# EAGLE schematic Week2ATTINY4-5-9-10 (EAGLE 8.4.3)
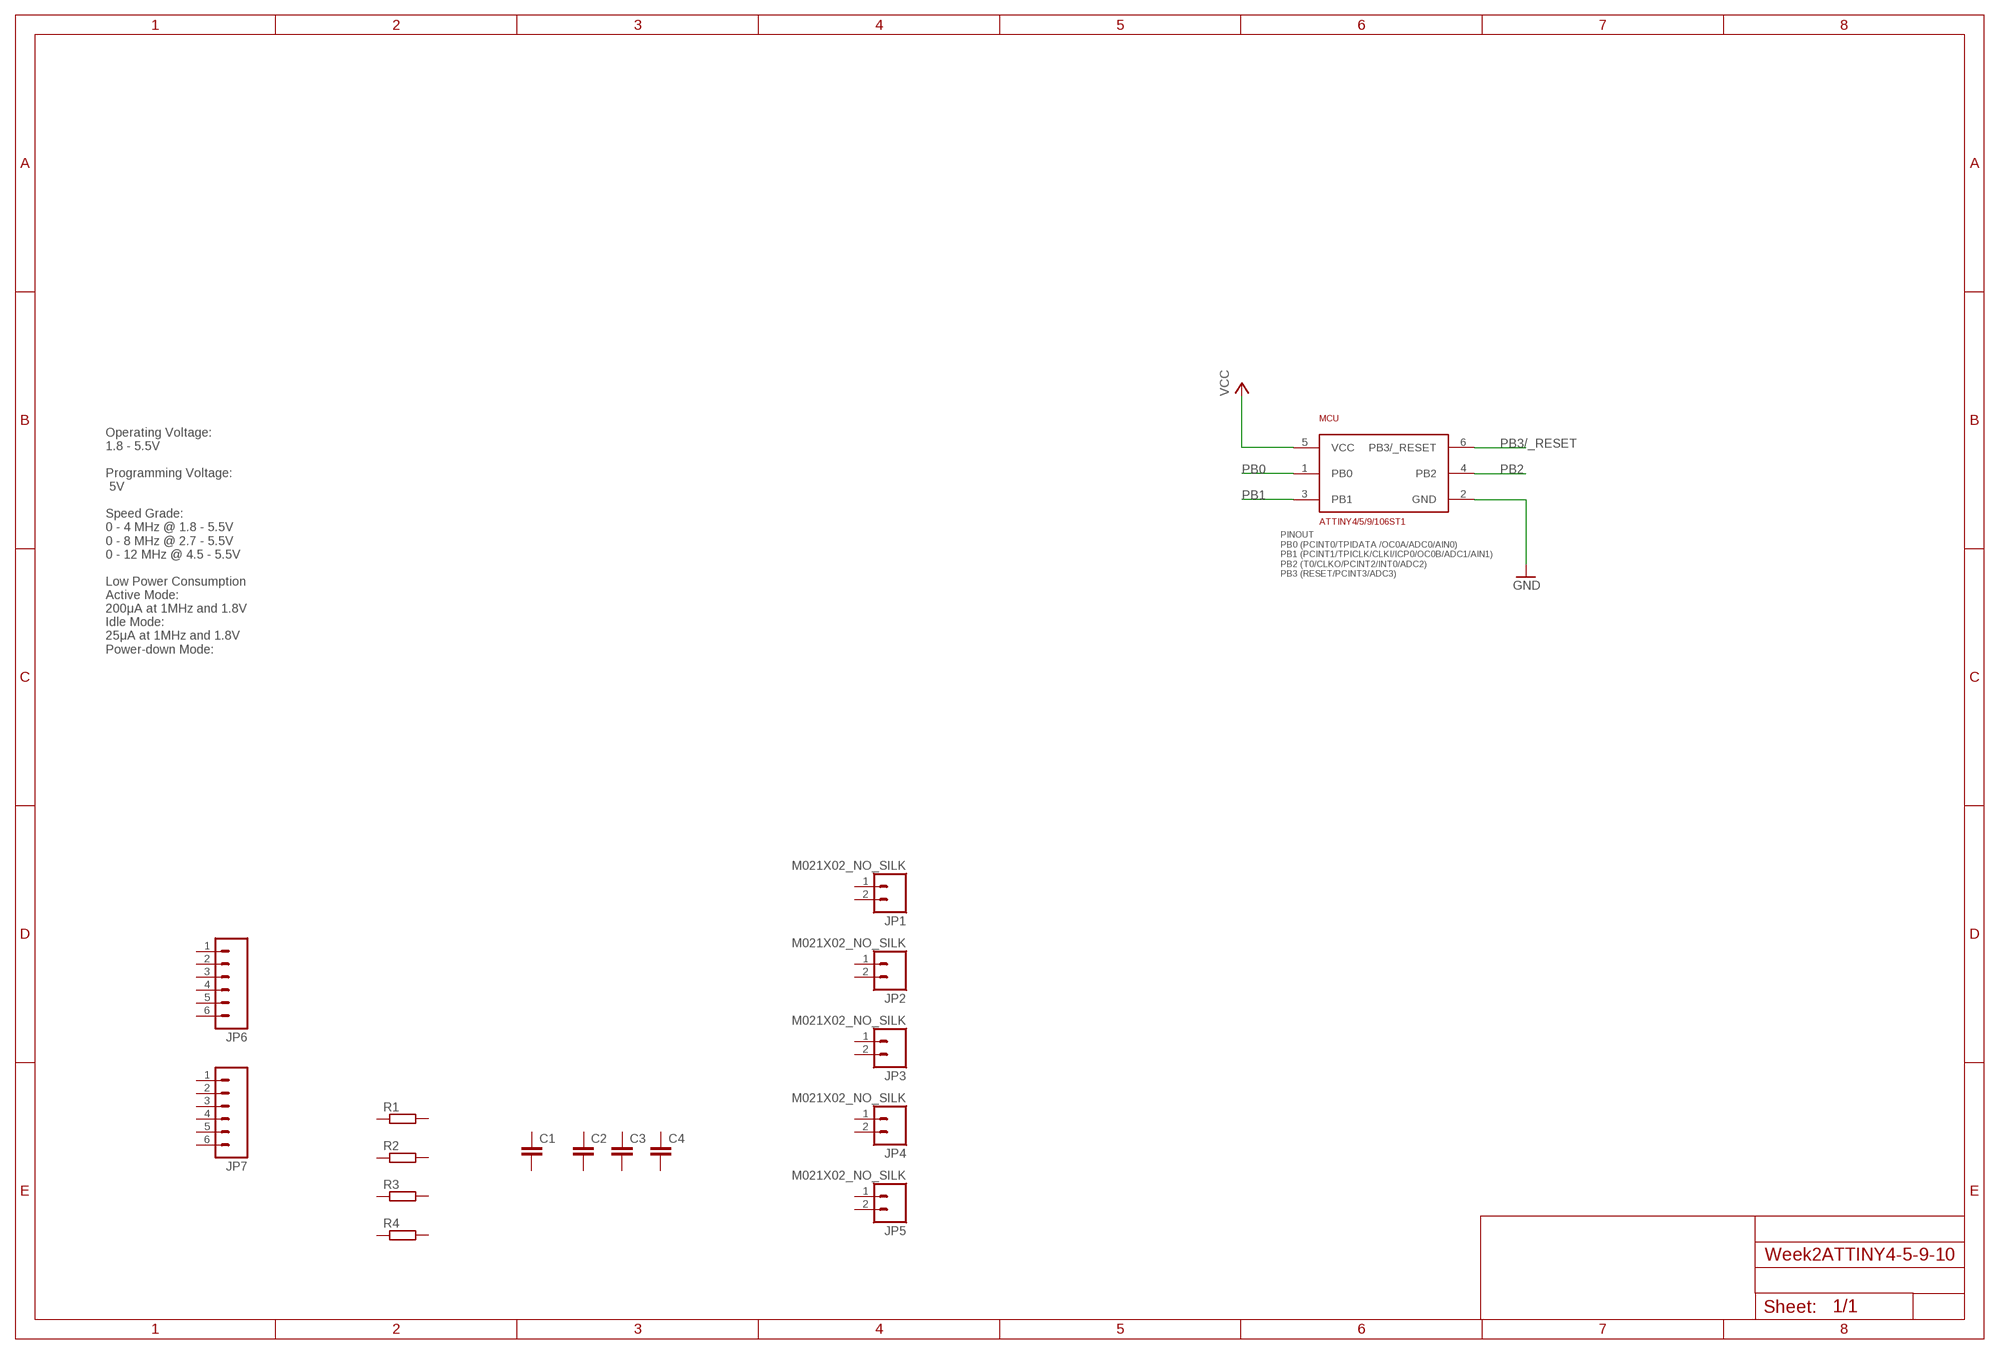
[diagram p0: schematic, sheet 1]

## Parts
C1  C-EUC0603K  [C0603K]
C2  C-EUC0603K  [C0603K]
C3  C-EUC0603K  [C0603K]
C4  C-EUC0603K  [C0603K]
JP1  M021X02_NO_SILK  [1X02_NO_SILK]
JP2  M021X02_NO_SILK  [1X02_NO_SILK]
JP3  M021X02_NO_SILK  [1X02_NO_SILK]
JP4  M021X02_NO_SILK  [1X02_NO_SILK]
JP5  M021X02_NO_SILK  [1X02_NO_SILK]
JP6  M06NO_SILK  [1X06_NO_SILK]
JP7  M06NO_SILK  [1X06_NO_SILK]
MCU  ATTINY4/5/9/106ST1  [SOT23-6AVR]
R1  R-EU_R0603  [R0603]
R2  R-EU_R0603  [R0603]
R3  R-EU_R0603  [R0603]
R4  R-EU_R0603  [R0603]

## Nets
GND: MCU.2(GND)
PB0: MCU.1(PB0)
PB1: MCU.3(PB1)
PB2: MCU.4(PB2)
PB3/_RESET: MCU.6(PB3/_RESET)
VCC: MCU.5(VCC)
Unconnected: C1.1 C1.2 C2.1 C2.2 C3.1 C3.2 C4.1 C4.2 JP1.1 JP1.2 JP2.1 JP2.2 JP3.1 JP3.2 JP4.1 JP4.2 JP5.1 JP5.2 JP6.1 JP6.2 JP6.3 JP6.4 JP6.5 JP6.6 JP7.1 JP7.2 JP7.3 JP7.4 JP7.5 JP7.6 R1.1 R1.2 R2.1 R2.2 R3.1 R3.2 R4.1 R4.2

## Notes on the sheet
- Operating Voltage: 
  1.8 - 5.5V
  
  Programming Voltage: 
   5V 
  
  Speed Grade: 
  0 - 4 MHz @ 1.8 - 5.5V 
  0 - 8 MHz @ 2.7 - 5.5V
  0 - 12 MHz @ 4.5 - 5.5V 
  
  Low Power Consumption 
  Active Mode: 
  200μA at 1MHz and 1.8V 
  Idle Mode: 
  25μA at 1MHz and 1.8V 
  Power-down Mode:

## Library data of the parts
C1-C4 = rcl:C-EU: CAPACITOR, European symbol
JP1-JP5 = SparkFun-Connectors:M02: Standard 2-pin 0.1" header. Use with - straight break away headers ( PRT-00116) - right angle break away headers (PRT-00553) - swiss pins (PRT-00743) - machine pins (PRT-00117) - female headers (PRT-00115) Molex polarized connector foot print use with: PRT-08233 with associated crimp pins and housings. 2.54_SCREWTERM for use with PRT-10571. 3.5mm Screw Terminal footprints for PRT-08084 5mm Screw Terminal footprints for use with PRT-08433
JP6 JP7 = SparkFun-Connectors:M06: Header 6 Standard 6-pin 0.1" header. Use with straight break away headers (SKU : PRT-00116), right angle break away headers (PRT-00553), swiss pins (PRT-00743), machine pins (PRT-00117), and female headers (PRT-00115). Molex polarized connector foot print use with SKU : PRT-08094 with associated crimp pins and housings. NOTES ON THE VARIANTS LOCK and LOCK_LONGPADS... This footprint was designed to help hold the alignment of a through-hole component (i.e. 6-pin header) while soldering it into place. You may notice that each hole has been shifted either up or down by 0.005 of an inch from it's more standard position (which is a perfectly straight line). This slight alteration caused the pins (the squares in the middle) to touch the edges of the holes. Because they are alternating, it causes a "brace" to hold the component in place. 0.005 has proven to be the perfect amount of "off-center" position when using our standard breakaway headers. Although looks a little odd when you look at the bare footprint, once you have a header in there, the alteration is very hard to notice. Also,if you push a header all the way into place, it is covered up entirely on the bottom side. This idea of altering the position of holes to aid alignment will be further integrated into the Sparkfun Library for other footprints. It can help hold any component with 3 or more connection pins.
MCU = eaglepartslib:ATTINY4/5/9/10
R1-R4 = rcl:R-EU_: RESISTOR, European symbol